# EAGLE design Power (EAGLE 6.4)
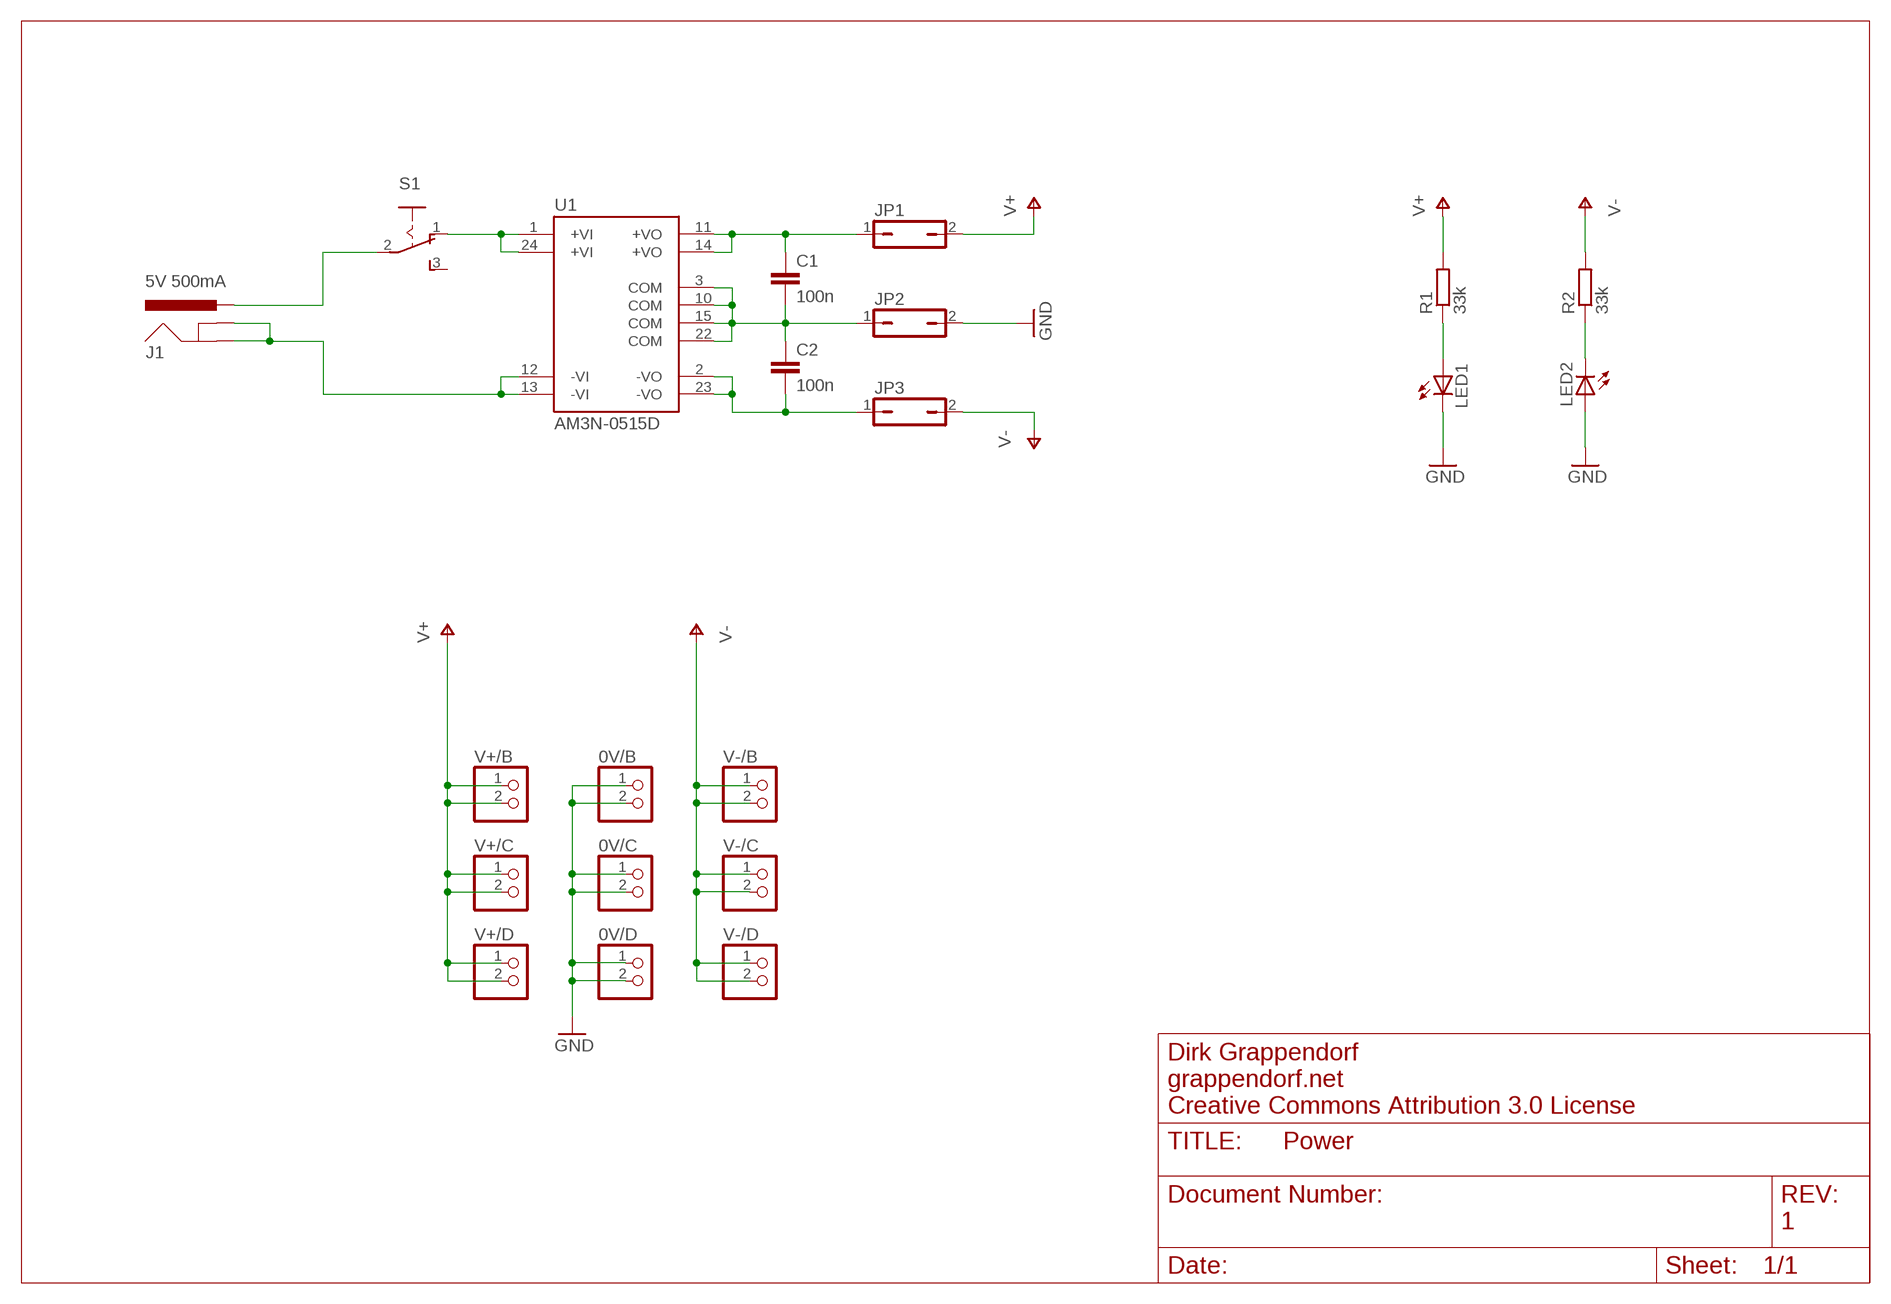
[diagram p0: schematic, sheet 1]

## Parts
0V/B  PINHD-1X2  [1X02]
0V/C  PINHD-1X2  [1X02]
0V/D  PINHD-1X2  [1X02]
C1  100n  C-EU025-025X050  [C025-025X050]
C2  100n  C-EU025-025X050  [C025-025X050]
J1  5V 500mA  POWER_JACKPTH  [POWER_JACK_PTH]
JP1  JP1Q  [JP1]
JP2  JP1Q  [JP1]
JP3  JP1Q  [JP1]
LED1  LED3MM  [LED3MM]
LED2  LED3MM  [LED3MM]
R1  33k  R-EU_0207/7  [0207/7]
R2  33k  R-EU_0207/7  [0207/7]
S1  REICHELT-SS_13ASP  [REICHELT-SS_13ASP]
U1  AM3N-0515D  [AM3N_DIL24]
V+/B  PINHD-1X2  [1X02]
V+/C  PINHD-1X2  [1X02]
V+/D  PINHD-1X2  [1X02]
V-/B  PINHD-1X2  [1X02]
V-/C  PINHD-1X2  [1X02]
V-/D  PINHD-1X2  [1X02]

## Nets
+VO: C1.1 JP1.1 U1.11(+VO) U1.14(+VO)
-VO: C2.2 JP3.1 U1.2(-VO) U1.23(-VO)
COM: C1.2 C2.1 JP2.1 U1.3(COM) U1.10(COM) U1.15(COM) U1.22(COM)
GND: 0V/B.1 0V/B.2 0V/C.1 0V/C.2 0V/D.1 0V/D.2 JP2.2 LED1.K(C) LED2.A
N$1: J1.PWR S1.2(P)
N$2: J1.GND J1.GNDBREAK U1.12(-VI) U1.13(-VI)
N$3: LED1.A R1.1
N$4: LED2.K(C) R2.1
N$5: S1.1(O) U1.1(+VI) U1.24(+VI)
V+: JP1.2 R1.2 V+/B.1 V+/B.2 V+/C.1 V+/C.2 V+/D.1 V+/D.2
V-: JP3.2 R2.2 V-/B.1 V-/B.2 V-/C.1 V-/C.2 V-/D.1 V-/D.2
Unconnected: S1.3(S)

## Notes on the sheet
- Dirk Grappendorf
- grappendorf.net
- Creative Commons Attribution 3.0 License
- 1

## Library data of the parts
0V/B 0V/C 0V/D V+/B V+/C V+/D V-/B V-/C V-/D = pinhead:PINHD-1X2: PIN HEADER
C1 C2 = rcl:C-EU: CAPACITOR, European symbol
J1 = SparkFun:POWER_JACK: Power Jack This is the standard 5.5mm barrel jack for power. The PTH is the most common, proven, reliable, footprint. All others are experimental. The Slot footprint only works if the mill layer is transmitted to the PCB fab house so be warned. Spark Fun Electronics SKU : PRT-00119. Mating wall wart : TOL-00298 (and others)
JP1-JP3 = jumper:JP1Q: JUMPER
LED1 LED2 = led:LED: LED OSRAM: - CHIPLED LG R971, LG N971, LY N971, LG Q971, LY Q971, LO R971, LY R971 LH N974, LH R974 LS Q976, LO Q976, LY Q976 LO Q996 - Hyper CHIPLED LW Q18S LB Q993, LB Q99A, LB R99A - SideLED LS A670, LO A670, LY A670, LG A670, LP A670 LB A673, LV A673, LT A673, LW A673 LH A674 LY A675 LS A676, LA A676, LO A676, LY A676, LW A676 LS A679, LY A679, LG A679 - Hyper Micro SIDELED® LS Y876, LA Y876, LO Y876, LY Y876 LT Y87S - SmartLED LW L88C, LW L88S LB L89C, LB L89S, LG L890 LS L89K, LO L89K, LY L89K LS L896, LA L896, LO L896, LY L896 - TOPLED LS T670, LO T670, LY T670, LG T670, LP T670 LSG T670, LSP T670, LSY T670, LOP T670, LYG T670 LG T671, LOG T671, LSG T671 LB T673, LV T673, LT T673, LW T673 LH T674 LS T676, LA T676, LO T676, LY T676, LB T676, LH T676, LSB T676, LW T676 LB T67C, LV T67C, LT T67C, LS T67K, LO T67K, LY T67K, LW E67C LS E67B, LA E67B, LO E67B, LY E67B, LB E67C, LV E67C, LT E67C LW T67C LS T679, LY T679, LG T679 LS T770, LO T770, LY T770, LG T770, LP T770 LB T773, LV T773, LT T773, LW T773 LH T774 LS E675, LA E675, LY E675, LS T675 LS T776, LA T776, LO T776, LY T776, LB T776 LHGB T686 LT T68C, LB T68C - Hyper Mini TOPLED® LB M676 - Mini TOPLED Santana® LG M470 LS M47K, LO M47K, LY M47K Source: http://www.osram.convergy.de LUXEON: - LUMILED® LXK2-PW12-R00, LXK2-PW12-S00, LXK2-PW14-U00, LXK2-PW14-V00 LXK2-PM12-R00, LXK2-PM12-S00, LXK2-PM14-U00 LXK2-PE12-Q00, LXK2-PE12-R00, LXK2-PE12-S00, LXK2-PE14-T00, LXK2-PE14-U00 LXK2-PB12-K00, LXK2-PB12-L00, LXK2-PB12-M00, LXK2-PB14-N00, LXK2-PB14-P00, LXK2-PB14-Q00 LXK2-PR12-L00, LXK2-PR12-M00, LXK2-PR14-Q00, LXK2-PR14-R00 LXK2-PD12-Q00, LXK2-PD12-R00, LXK2-PD12-S00 LXK2-PH12-R00, LXK2-PH12-S00 LXK2-PL12-P00, LXK2-PL12-Q00, LXK2-PL12-R00 Source: www.luxeon.com KINGBRIGHT: KA-3528ASYC Source: www.kingbright.com
R1 R2 = rcl:R-EU_: RESISTOR, European symbol
S1 = grapelabs-switches:REICHELT-SS_13ASP: SLIDING SWITCH Distributor Buerklin, 11G810
U1 = aimtec_am3n:AM3N-*D: aimtec AM3N Series: 3 W DC/DC-Converters; ±10% Input Range; DIL24-compatible AM3N-xxyyD: Dual output (±); 1000 V I/O-isolation Packages: DIL24-compatible, metal Note: actual pin assignment depends on output configuration and i/o-isolation voltage, see description Source: http://www.aimtec.ca (DC-DC Converters Catalogue Rev. 1.1) Technologies: xx input voltage (V) yy output voltage (V) (D) Dual output (±) (none) 1000 V I/O-isolation voltage Author: Dipl.-Ing. FH Rainer Bayer HHN Hochschule Heilbronn (Heilbronn University), rainer.bayer@hs-heilbronn.de Ingenieurbüro ing-rb, mail@ing-rb.de

## Board
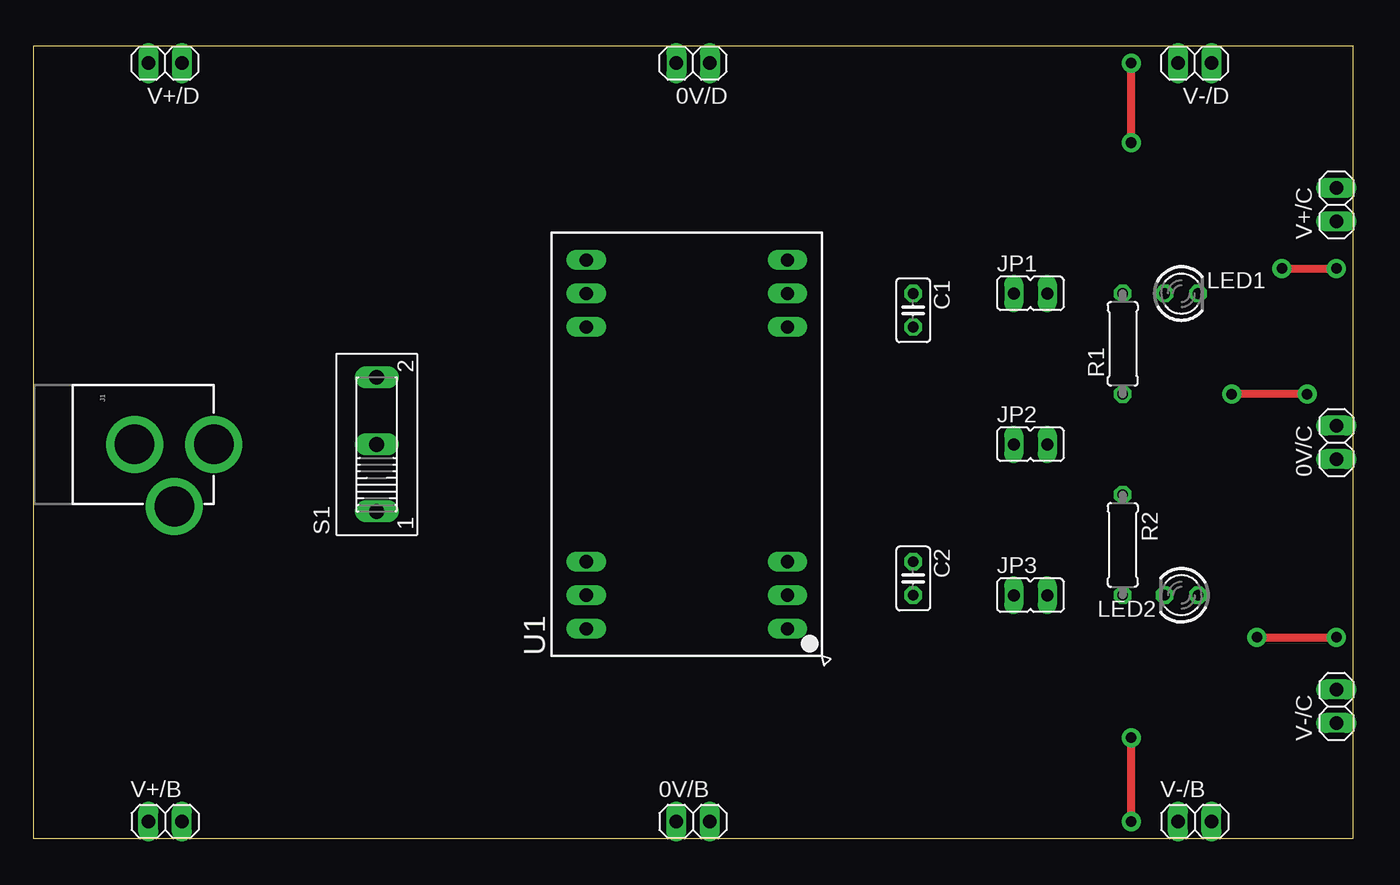
[diagram p1: board, top side]
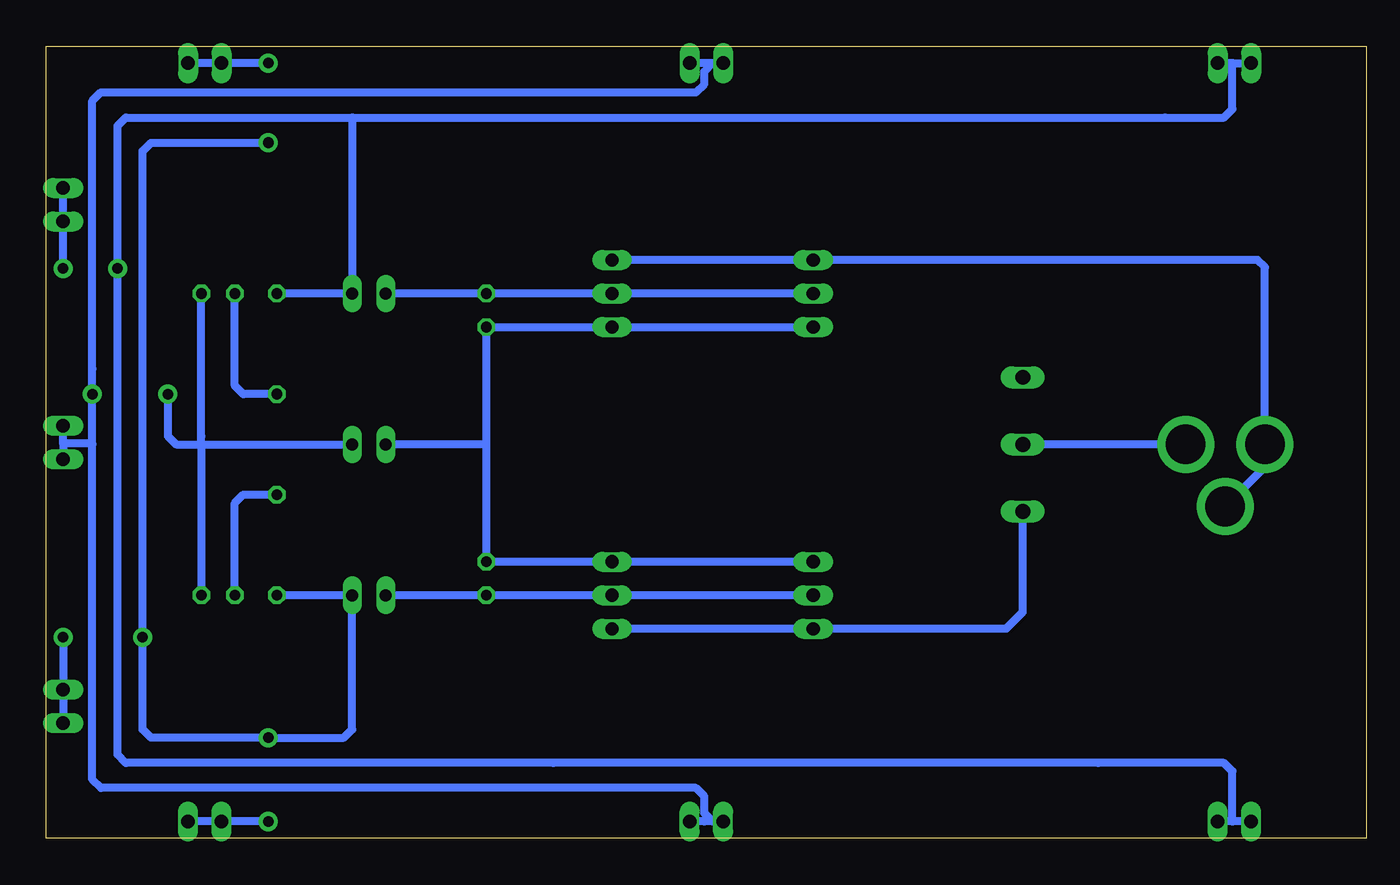
[diagram p2: board, bottom side, seen from below]

Size 100 x 60 mm. Coordinates in mm from the lower left corner, seen from the top.
Outline: 0,0 100,0 100,60 0,60 0,0
Copper layers (1*16): Top 0.035mm / dielectric 1.5mm / Bottom 0.035mm
Design rules "default *": minimum track width 10mil, minimum drill 24mil, track to track 8mil, track to pad 8mil, pad to pad 8mil, via to via 8mil, smd to smd 8mil, copper to edge 40mil, drill to drill 8mil, minimum pad ring 10mil, minimum via ring 8mil, stop-mask expansion 4mil, vias tented up to drill 0mil, thermal gap 10mil

### Footprints (pad centres in the part's own frame; a part is rotated, then mirrored left to right if it is on the bottom)
1X02 = drill 1.016 long: 1 -1.27,0; 2 1.27,0
C025-025X050 = drill 0.813 octagon: 1 -1.27,0; 2 1.27,0
POWER_JACK_PTH = drill 2.997 pad 4.318: GND 0,7.7; GNDBREAK 4.7,10.7; PWR 0,13.7
JP1 = drill 0.914 long: 1 0,-1.27; 2 0,1.27
LED3MM = drill 0.813 octagon: A -1.27,0; K 1.27,0
0207/7 = drill 0.813 octagon: 1 -3.81,0; 2 3.81,0
REICHELT-SS_13ASP = drill 1.118 long: 1 -5.08,0; 2 0,0; 3 5.08,0
AM3N_DIL24 = drill 1 long: 1 -13.97,-7.62; 2 -11.43,-7.62; 3 -8.89,-7.62; 10 8.89,-7.62; 11 11.43,-7.62; 12 13.97,-7.62; 13 13.97,7.62; 14 11.43,7.62; 15 8.89,7.62; 22 -8.89,7.62; 23 -11.43,7.62; 24 -13.97,7.62

### Placement (x,y rotation side)
0V/B  50,1.27 0 top
0V/C  98.73,30 90 top
0V/D  50,58.73 180 top
C1  66.67,40.01 270 top
C2  66.67,19.68 270 top
J1  0,29.84 270 top
JP1  75.56,41.27 270 top
JP2  75.56,29.84 270 top
JP3  75.56,18.41 270 top
LED1  87,41.27 0 top
LED2  87,18.41 180 top
R1  82.55,37.47 90 top
R2  82.55,22.23 270 top
S1  26.04,29.84 90 top
U1  49.53,29.84 90 top
V+/B  10,1.27 0 top
V+/C  98.73,48 90 top
V+/D  10,58.73 180 top
V-/B  88,1.27 0 top
V-/C  98.73,10 90 top
V-/D  88,58.73 180 top

### Tracks (layer width: path | path; a pad name or v marks a point on that pad's centre or on a via)
+VO
  Bottom 0.61: U1.14 U1.11 C1.1 JP1.1
-VO
  Bottom 0.61: U1.23 U1.2 C2.2 JP3.1
COM
  Bottom 0.61: U1.22 U1.3 C2.1 66.67,29.21 | U1.15 U1.10 C1.2 66.67,29.84 | 66.67,29.21 66.67,29.84 | 66.67,29.84 JP2.1 | 66.67,29.21 66.67,29.84
GND  (via drill 0.8)
  Top 0.61: v96.52,33.66 v90.81,33.66
  Bottom 0.61: 49.53,58.73 0V/D.2 | 49.53,58.73 50.08,58.73 0V/D.1 | 98.73,29.93 0V/C.1 98.48,28.48 | 98.73,29.93 0V/C.2 | 0V/B.1 49.53,1.27 | 49.53,1.27 50.16,1.27 0V/B.2 | 96.52,29.84 96.52,4.45 95.89,3.81 50.8,3.81 50.16,3.17 50.16,1.91 49.53,1.27 | 96.52,29.84 v96.52,33.66 | v96.52,33.66 96.52,35.56 | 96.52,35.56 96.52,55.88 95.89,56.52 50.8,56.52 50.16,57.15 50.16,58.09 49.53,58.73 | 98.73,29.93 96.6,29.93 96.52,29.84 | 88.27,29.84 90.17,29.84 90.81,30.48 v90.81,33.66 | v96.52,33.66 96.52,35.56 | 88.27,29.84 LED2.A | 88.27,29.84 88.27,30.48 | 88.27,30.48 LED1.K | 88.27,29.84 JP2.2 | 88.27,29.84 88.27,30.48
N$1
  Bottom 0.61: J1.PWR S1.2
N$2
  Bottom 0.61: U1.12 U1.13 8.26,43.81 7.7,43.26 J1.GND 7.7,28.14 J1.GNDBREAK
N$3
  Bottom 0.61: R1.1 85.09,33.66 85.72,34.29 LED1.A
N$4
  Bottom 0.61: R2.1 85.09,26.04 85.72,25.4 LED2.K
N$5
  Bottom 0.61: U1.1 U1.24 27.3,15.88 26.04,17.14 S1.1
V+  (via drill 0.8)
  Top 0.61: v94.61,43.18 v98.73,43.18
  Bottom 0.61: 10.16,58.73 V+/D.2 | 10.16,58.73 V+/D.1 | V+/C.2 V+/C.1 98.73,43.32 v98.73,43.18 | V+/B.1 10.16,1.27 | 10.16,1.27 V+/B.2 | 76.83,54.61 93.98,54.61 94.61,53.98 v94.61,43.18 94.61,6.35 93.98,5.71 61.59,5.71 20.32,5.71 10.79,5.71 10.16,5.08 10.16,1.27 | 76.83,54.61 15.24,54.61 10.79,54.61 10.16,55.24 10.16,58.73 | R1.2 JP1.2 76.83,54.61
V-  (via drill 0.8)
  Top 0.61: v92.71,15.24 v98.73,15.24 | v83.19,52.7 v83.19,58.73 | v83.19,1.27 v83.19,7.62
  Bottom 0.61: V-/C.1 V-/C.2 98.73,14.91 v98.73,15.24 | V-/B.2 V-/B.1 v83.19,1.27 | V-/D.1 V-/D.2 83.32,58.73 v83.19,58.73 | v83.19,7.62 83.82,7.62 | 83.82,7.62 92.08,7.62 92.71,8.26 v92.71,15.24 92.71,52.07 92.08,52.7 v83.19,52.7 | 83.82,7.62 77.47,7.62 76.83,8.26 JP3.2 R2.2